# EAGLE design main (EAGLE 8.4.0)
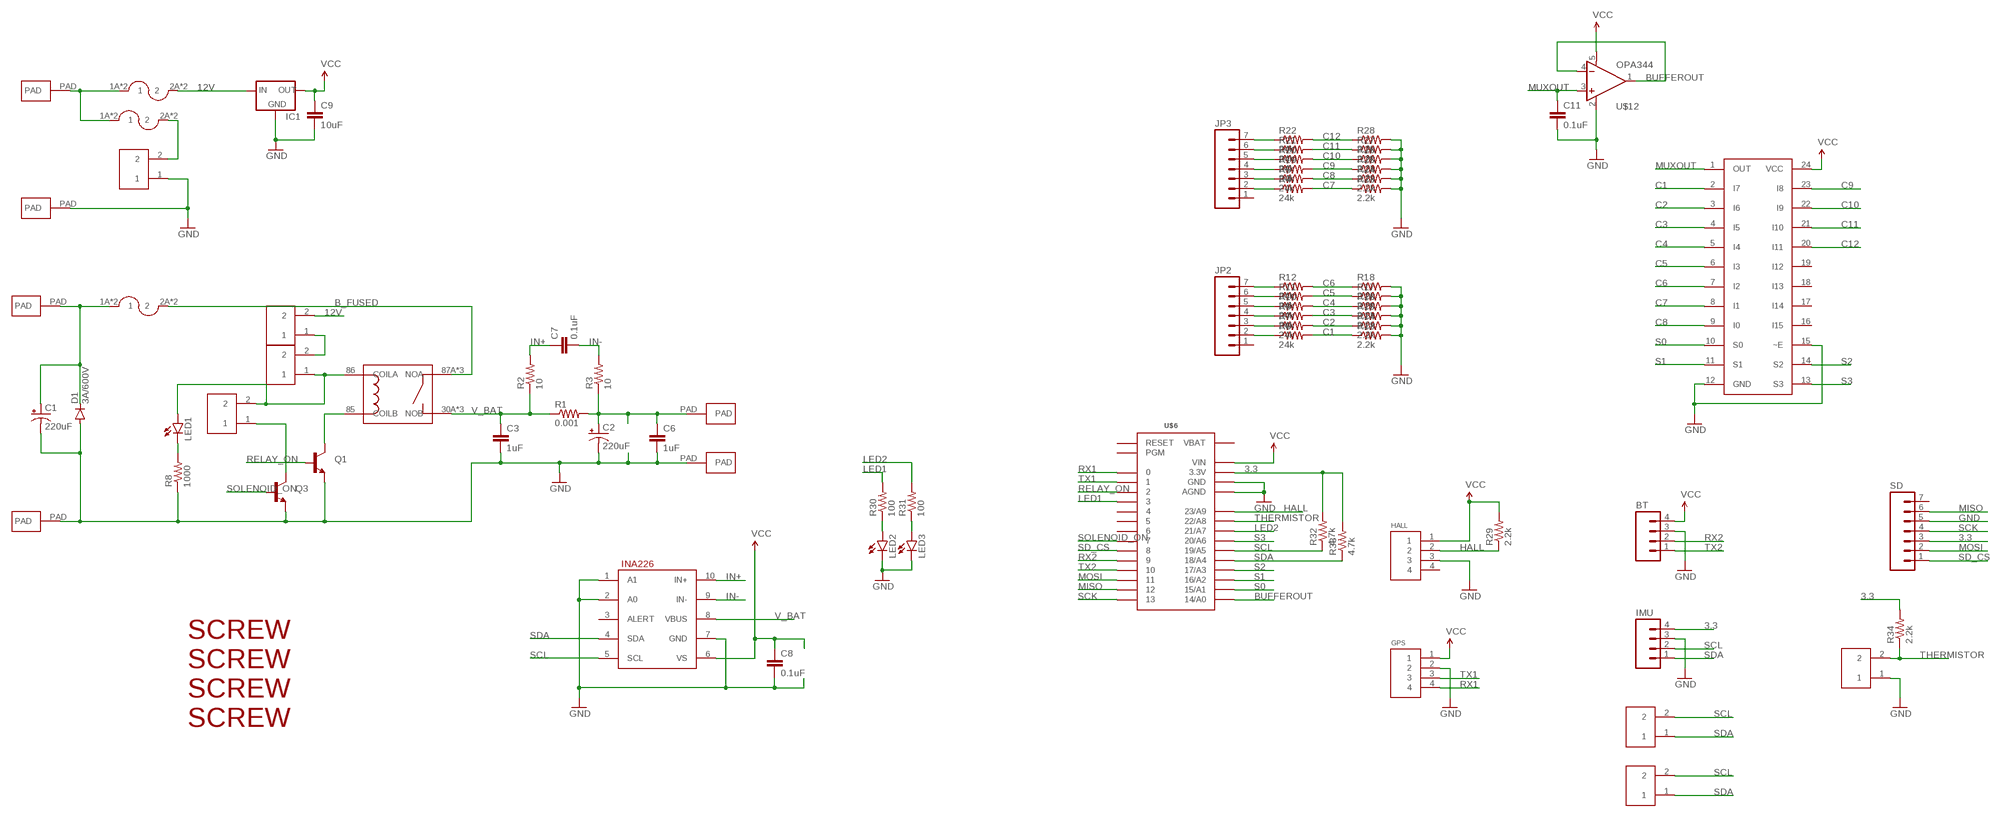
[diagram p0: schematic, sheet 1]

## Parts
BT  M04PTH  [1X04]
C1  220uF  CAP_POLPTH4  [CPOL-RADIAL-1000UF-25V]
C2  220uF  CAP_POLPTH4  [CPOL-RADIAL-1000UF-25V]
C3  1uF  CAP1206  [1206]
C6  1uF  CAP1206  [1206]
C7  0.1uF  CAP0603-CAP  [0603-CAP]
C8  0.1uF  CAP0603-CAP  [0603-CAP]
C9  10uF  CAP0805  [0805]
C11  0.1uF  CAP0603-CAP  [0603-CAP]
D1  3A/600V  DIODEES3J  [SMC]
GPS  GPS  HEADER4VALULOK  [4PINVALULOK]
HALL  HEADER4VALULOK  [4PINVALULOK]
IC1  V_REG_78XXSINK  [TO220-IGO]
IMU  M04PTH  [1X04]
JP2  M07  [1X07]
JP3  M07  [1X07]
LED1  LED1206  [LED-1206]
LED2  LED1206  [LED-1206]
LED3  LED1206  [LED-1206]
Q1  TRANSISTOR_NPNSMD2  [SOT223]
Q3  TRANSISTOR_NPNSMD2  [SOT223]
R1  0.001  RESISTOR2512  [R2512]
R2  10  RESISTOR0603-RES  [0603-RES]
R3  10  RESISTOR0603-RES  [0603-RES]
R4  24k  RESISTOR0603-RES  [0603-RES]
R5  24k  RESISTOR0603-RES  [0603-RES]
R6  24k  RESISTOR0603-RES  [0603-RES]
R7  24k  RESISTOR0603-RES  [0603-RES]
R8  1000  RESISTOR0603-RES  [0603-RES]
R9  24k  RESISTOR0603-RES  [0603-RES]
R10  24k  RESISTOR0603-RES  [0603-RES]
R11  24k  RESISTOR0603-RES  [0603-RES]
R12  24k  RESISTOR0603-RES  [0603-RES]
R13  2.2k  RESISTOR0603-RES  [0603-RES]
R14  2.2k  RESISTOR0603-RES  [0603-RES]
R15  2.2k  RESISTOR0603-RES  [0603-RES]
R16  2.2k  RESISTOR0603-RES  [0603-RES]
R17  2.2k  RESISTOR0603-RES  [0603-RES]
R18  2.2k  RESISTOR0603-RES  [0603-RES]
R19  24k  RESISTOR0603-RES  [0603-RES]
R20  24k  RESISTOR0603-RES  [0603-RES]
R21  24k  RESISTOR0603-RES  [0603-RES]
R22  24k  RESISTOR0603-RES  [0603-RES]
R23  2.2k  RESISTOR0603-RES  [0603-RES]
R24  2.2k  RESISTOR0603-RES  [0603-RES]
R25  2.2k  RESISTOR0603-RES  [0603-RES]
R26  2.2k  RESISTOR0603-RES  [0603-RES]
R27  2.2k  RESISTOR0603-RES  [0603-RES]
R28  2.2k  RESISTOR0603-RES  [0603-RES]
R29  2.2k  RESISTOR0603-RES  [0603-RES]
R30  100  RESISTOR0603-RES  [0603-RES]
R31  100  RESISTOR0603-RES  [0603-RES]
R32  4.7k  RESISTOR0603-RES  [0603-RES]
R33  4.7k  RESISTOR0603-RES  [0603-RES]
R34  2.2k  RESISTOR0603-RES  [0603-RES]
SD  M07  [1X07]
U$1  INA226  [PSOP-10]
U$2  PAD  [PAD]
U$3  PAD  [PAD]
U$4  PAD  [PAD]
U$5  PAD  [PAD]
U$6  TEENSY_3.0_BASIC  [TEENSY_3.0_BASIC]
U$7  RELAY  [PANASONIC_HP_RELAY]
U$8  FUSE  [AUTO_FUSE]
U$9  HEADER2  [2PINVALULOK]
U$10  HEADER2  [2PINVALULOK]
U$11  CD74HC4067  [SO-24DW]
U$12  OPA344  [SOT23-5]
U$13  SCREW  [M3HOLE]
U$14  SCREW  [M3HOLE]
U$15  SCREW  [M3HOLE]
U$16  SCREW  [M3HOLE]
U$17  HEADER2  [2PINVALULOK]
U$18  FUSE  [AUTO_FUSE]
U$19  HEADER2  [2PINVALULOK]
U$20  PAD  [PAD]
U$21  PAD  [PAD]
U$22  FUSE  [AUTO_FUSE]
U$23  HEADER2  [2PINVALULOK]
U$24  HEADER2  [2PINVALULOK]
U$25  HEADER2  [2PINVALULOK]

## Nets
3.3: IMU.4 R32.2 R33.2 R34.2 SD.3 U$6.3.3V U$6.3.3V1(3.3V)
12V: IC1.IN U$10.2 U$22.2A U$22.2B
B_FUSED: U$7.87A(NOA) U$7.87B(NOA) U$7.87C(NOA) U$8.2A U$8.2B
B_OUT: C2.+ C6.1 R1.2 R3.1 U$4.PAD
B_RAW: C1.+ D1.C U$2.PAD U$8.1A U$8.1B
BUFFEROUT: U$6.14/A0 U$12.1(OUT) U$12.4(-IN)
C1: R6.2 R13.1 U$11.2(I7)
C2: R7.2 R14.1 U$11.3(I6)
C3: R9.2 R15.1 U$11.4(I5)
C4: R10.2 R16.1 U$11.5(I4)
C5: R11.2 R17.1 U$11.6(I3)
C6: R12.2 R18.1 U$11.7(I2)
C7: R4.2 R23.1 U$11.8(I1)
C8: R5.2 R24.1 U$11.9(I0)
C9: R19.2 R25.1 U$11.23(I8)
C10: R20.2 R26.1 U$11.22(I9)
C11: R21.2 R27.1 U$11.21(I10)
C12: R22.2 R28.1 U$11.20(I11)
GND: BT.3 C1.- C2.- C3.2 C6.2 C8.2 C9.2 C11.2 D1.A GPS.2 HALL.3 IC1.GND IMU.3 LED2.C LED3.C Q1.3(E) Q3.3(E) R8.1 R13.2 R14.2 R15.2 R16.2 R17.2 R18.2 R23.2 R24.2 R25.2 R26.2 R27.2 R28.2 SD.5 U$1.1(A1) U$1.2(A0) U$1.7(GND) U$3.PAD U$5.PAD U$6.AGND U$6.GND U$6.GND1(GND) U$11.12(GND) U$11.15(~E) U$12.2(V-) U$17.1 U$19.1 U$21.PAD
HALL: HALL.2 R29.1 U$6.23/A9
IN+: C7.1 R2.2 U$1.10(IN+)
IN-: C7.2 R3.2 U$1.9(IN-)
LED1: R30.2 U$6.3
LED2: R31.2 U$6.21/A7
MISO: SD.6 U$6.12
MOSI: SD.2 U$6.11
MUXOUT: C11.1 U$11.1(OUT) U$12.3(+IN)
N$1: JP2.7 R12.1
N$2: LED2.A R30.1
N$3: JP2.6 R11.1
N$4: JP2.5 R10.1
N$5: U$18.2A U$18.2B U$19.2
N$6: JP2.4 R9.1
N$7: U$9.2 U$10.1
N$8: JP2.3 R7.1
N$9: LED1.C R8.2
N$10: Q1.2(C) U$7.85(COILB)
N$11: JP2.2 R6.1
N$14: JP3.7 R22.1
N$15: JP3.6 R21.1
N$16: JP3.5 R20.1
N$17: JP3.4 R19.1
N$18: JP3.3 R5.1
N$19: JP3.2 R4.1
N$20: LED3.A R31.1
N$22: LED1.A U$7.86(COILA) U$9.1 U$23.2
N$23: U$18.1A U$18.1B U$20.PAD U$22.1A U$22.1B
N$24: Q3.2(C) U$23.1
RELAY_ON: Q1.1(B) U$6.2
RX1: GPS.4 U$6.0
RX2: BT.2 U$6.9
S0: U$6.15/A1 U$11.10(S0)
S1: U$6.16/A2 U$11.11(S1)
S2: U$6.17/A3 U$11.14(S2)
S3: U$6.20/A6 U$11.13(S3)
SCK: SD.4 U$6.13
SCL: IMU.2 R32.1 U$1.5(SCL) U$6.19/A5 U$24.2 U$25.2
SD_CS: SD.1 U$6.8
SDA: IMU.1 R33.1 U$1.4(SDA) U$6.18/A4 U$24.1 U$25.1
SOLENOID_ON: Q3.1(B) U$6.7
THERMISTOR: R34.1 U$6.22/A8 U$17.2
TX1: GPS.3 U$6.1
TX2: BT.1 U$6.10
V_BAT: C3.1 R1.1 R2.1 U$1.8(VBUS) U$7.30A(NOB) U$7.30B(NOB) U$7.30C(NOB)
VCC: BT.4 C8.1 C9.1 GPS.1 HALL.1 IC1.OUT R29.2 U$1.6(VS) U$6.VIN U$11.24(VCC) U$12.5(V+)
Unconnected: HALL.4 JP2.1 JP3.1 SD.7 U$1.3(ALERT) U$6.4 U$6.5 U$6.6 U$6.PGM U$6.RESET U$11.16(I15) U$11.17(I14) U$11.18(I13) U$11.19(I12)

## Power pins joined to a net without a drawn wire
VBAT: U$6.VBAT

## Library data of the parts
BT IMU = SparkFun-Connectors:M04: Header 4 Standard 4-pin 0.1" header. Use with straight break away headers (SKU : PRT-00116), right angle break away headers (PRT-00553), swiss pins (PRT-00743), machine pins (PRT-00117), and female headers (PRT-00115). Molex polarized connector foot print use with SKU : PRT-08231 with associated crimp pins and housings. 1MM SMD Version SKU: PRT-10208
C1 C2 = SparkFun-Capacitors:CAP_POL: Capacitor Polarized These are standard SMD and PTH capacitors. Normally 10uF, 47uF, and 100uF in electrolytic and tantalum varieties. Always verify the external diameter of the through hole cap, it varies with capacity, voltage, and manufacturer. The EIA devices should be standard.
C3 C6 = SparkFun-Capacitors:CAP: Capacitor Standard 0603 ceramic capacitor, and 0.1" leaded capacitor.
C7-C9 C11 = SparkFun-Passives:CAP: Capacitor Standard 0603 ceramic capacitor, and 0.1" leaded capacitor.
D1 = SparkFun-DiscreteSemi:DIODE: Diode These are standard reverse protection diodes and small signal diodes. SMA package can handle up to about 1A. SOD-323 can handle about 200mA. What the SOD-323 package when ordering, there are some mfgs out there that are 5-pin packages.; PROD_ID: DIO-12441
GPS HALL = Custom_old:HEADER4
IC1 = SparkFun-PowerIC:V_REG_78XX: Voltage Regulator Standard 7805 5V regulator. IGO (Input Ground Output). Spark Fun Electronics SKU : COM-00107
JP2 JP3 SD = SparkFun-Connectors:M07: Header 7 Standard 7-pin 0.1" header. Use with straight break away headers (SKU : PRT-00116), right angle break away headers (PRT-00553), swiss pins (PRT-00743), machine pins (PRT-00117), and female headers (PRT-00115). NOTES ON THE VARIANTS LOCK and LOCK_LONGPADS... This footprint was designed to help hold the alignment of a through-hole component (i.e. 7-pin header) while soldering it into place. You may notice that each hole has been shifted either up or down by 0.005 of an inch from it's more standard position (which is usually a perfectly straight line). This slight alteration caused the pins (the squares in the middle) to touch the edges of the holes. Because they are alternating, it causes a "brace" to hold the header in place. 0.005 has proven to be the perfect amount of "off-center" position when using our standard breakaway headers. Although looks a little odd when you look at the bare footprint, once you have a header in there, the alteration is very hard to notice. Also, if you push a header all the way into place, it is covered up entirely on the bottom side. This idea of altering the position of holes to aid alignment will be further integrated into the Sparkfun Library for other footprints. It can help hold any component with 3 or more connection pins.
LED1-LED3 = SparkFun-LED:LED: LEDs Standard schematic elements and footprints for 5mm, 3mm, 1206, and 0603 sized LEDs. 5mm - Spark Fun Electronics SKU : COM-00529 (and others)
Q1 Q3 = SparkFun-DiscreteSemi:TRANSISTOR_NPN: Generic NPN BJT MMBT2222A - TRANS-08049 (SOT-23, 1A 40V) MPSA42 - TRANS-09116 (SOT-23, 500mA 300V) MMBT5088LT1G - TRANS-11160 (SOT-23, 50 mA 30V) BC547 - COM-08928 <http://www.sparkfun.com/products/8928> (TO-92 45V 100mA) (1.Collector 2.Base 3.Emitter) 2N3904 - COM-00521 <http://www.sparkfun.com/products/521> (TO-92 40V 200mA) (1.Emitter 2.Base 3.Collector) P2N2222A - COM-12852 <http://www.sparkfun.com/products/12852> (TO-92 40V 600mA) (1.Collector 2.Base 3.Emitter)
R1 = SparkFun-Resistors:RESISTOR: Resistor Basic schematic elements and footprints for 0603, 1206, and PTH resistors.
R2-R34 = SparkFun-Passives:RESISTOR: Resistor Basic schematic elements and footprints for 0603, 1206, and PTH resistors.
U$1 = Custom_old:INA226
U$2-U$5 U$20 U$21 = Custom_old:PAD
U$6 = Teensy3.0:TEENSY_3.0_BASIC: Basic Teensy 3.0 with none of the 'inner' pins enabled. See '+4', 'AllAnalogPins", and 'AllPins' packages for additional pin holes, as needed.
U$7 = Custom_old:RELAY
U$8 U$18 U$22 = Custom_old:FUSE
U$9 U$10 U$17 U$19 U$23-U$25 = Custom_old:HEADER2
U$11 = Custom_old:CD74HC4067
U$12 = SparkFun-AnalogIC:OPA344: Single gate rail-to-rail output op-amp. Inputs extend 300mV past rails.
U$13-U$16 = Custom_old:SCREW

## Board
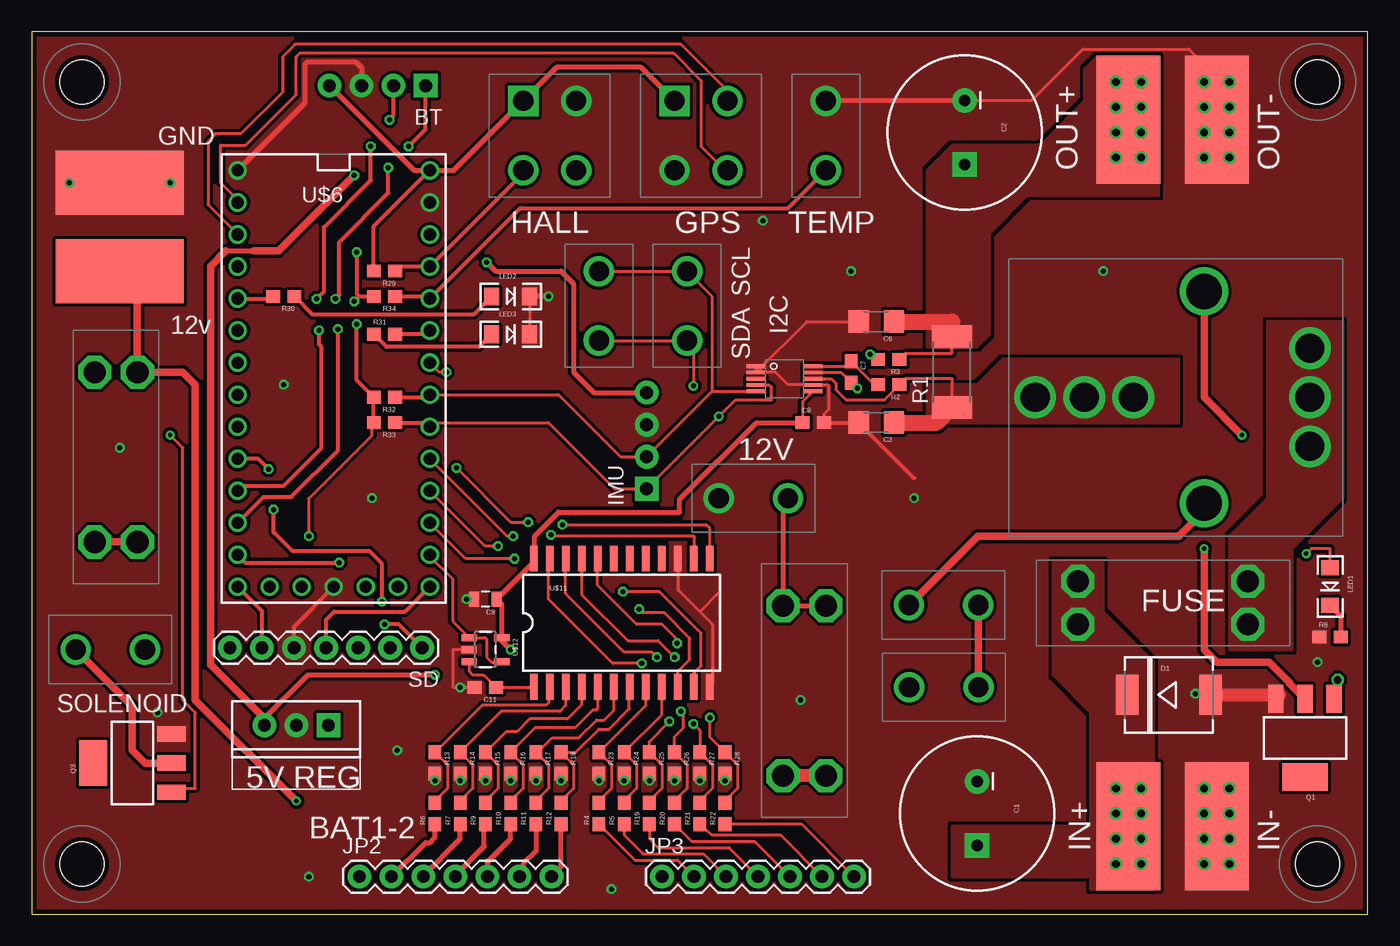
[diagram p1: board, top side]
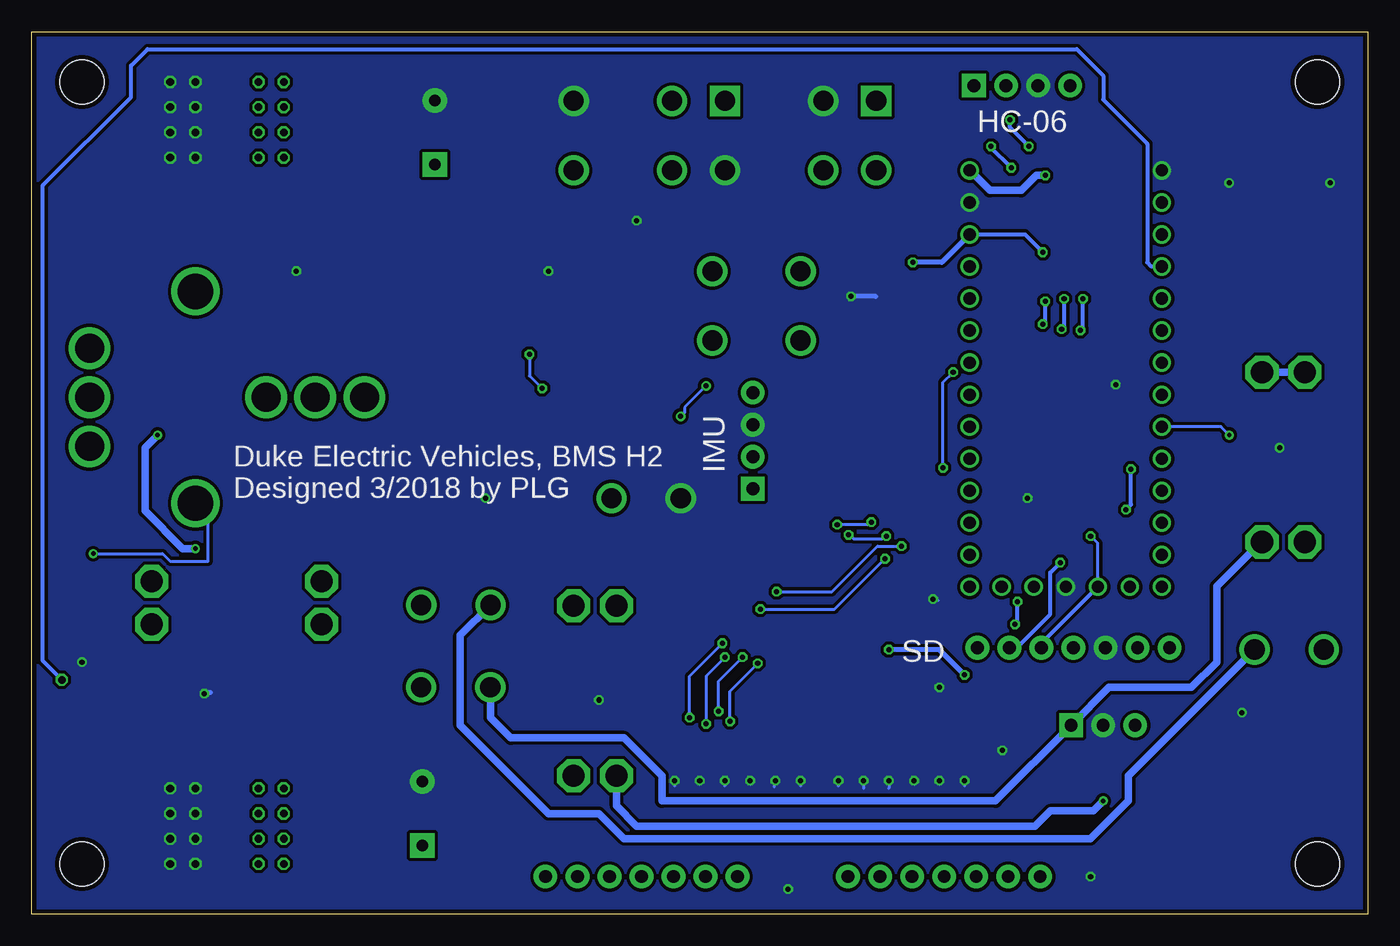
[diagram p2: board, bottom side, seen from below]

Size 106 x 70 mm. Coordinates in mm from the lower left corner, seen from the top.
Outline: 0,0 106,0 106,70 0,70 0,0
Copper layers (1*16): Top 0.0356mm / dielectric 1.5011mm / Bottom 0.0356mm
Design rules "PatrickOSHPARK *": minimum track width 6mil, minimum drill 13mil, track to track 6mil, track to pad 6mil, pad to pad 6mil, via to via 6mil, smd to smd 6mil, copper to edge 15mil, drill to drill 6mil, minimum pad ring 7mil, minimum via ring 7mil, stop-mask expansion 3mil, vias tented up to drill 20mil, thermal gap 10mil

### Footprints (pad centres in the part's own frame; a part is rotated, then mirrored left to right if it is on the bottom)
1X04 = drill 1.016 pad 1.88 square: 1 0,0 | drill 1.016 pad 1.88: 2 2.54,0; 3 5.08,0; 4 7.62,0
CPOL-RADIAL-1000UF-25V = drill 0.9 pad 1.93 square: + 2.54,0 | drill 0.9 pad 1.93: - -2.54,0
1206 = smd 1.6 x 1.8: 1 -1.4,0; 2 1.4,0
0603-CAP = smd 1.1 x 1: 1 -0.85,0; 2 0.85,0
0805 = smd 0.8 x 1.2: 1 -0.9,0; 2 0.9,0
SMC = smd 1.778 x 3.175: A 3.302,0; C -3.302,0
4PINVALULOK = drill 1.6 square: 1 0,5.5 | drill 1.6: 2 0,0; 3 4.2,5.5; 4 4.2,0
TO220-IGO = drill 1 pad 1.88: GND 0,0; OUT 2.54,0 | drill 1 pad 1.88 square: IN -2.54,0
1X07 = drill 1.016 pad 1.88: 1 0,0; 2 2.54,0; 3 5.08,0; 4 7.62,0; 5 10.16,0; 6 12.7,0; 7 15.24,0
LED-1206 = smd 1.2 x 1.4: A -1.5,0; C 1.5,0
SOT223 = smd 1.219 x 2.235: 1 -2.311,-3.099; 2 0,-3.099; 3 2.311,-3.099 | smd 3.6 x 2.2: 4 0,3.099
R2512 = smd 1.8 x 3.2: 1 -2.8,0; 2 2.8,0
0603-RES = smd 1.1 x 1: 1 -0.85,0; 2 0.85,0
PSOP-10 = smd 1.5 x 0.3: 1 0,1; 2 0,0.5; 3 0,0; 4 0,-0.5; 5 0,-1; 6 4.5,-1; 7 4.5,-0.5; 8 4.5,0; 9 4.5,0.5; 10 4.5,1
PAD = smd 10.16 x 5.08: PAD 0,0
TEENSY_3.0_BASIC = drill 0.965: 0 -7.62,13.97; 1 -7.62,11.43; 2 -7.62,8.89; 3 -7.62,6.35; 3.3V 7.62,11.43; 3.3V1 -2.54,-16.51; 4 -7.62,3.81; 5 -7.62,1.27; 6 -7.62,-1.27; 7 -7.62,-3.81; 8 -7.62,-6.35; 9 -7.62,-8.89; 10 -7.62,-11.43; 11 -7.62,-13.97; 12 -7.62,-16.51; 13 7.62,-16.51; 14/A0 7.62,-13.97; 15/A1 7.62,-11.43; 16/A2 7.62,-8.89; 17/A3 7.62,-6.35; 18/A4 7.62,-3.81; 19/A5 7.62,-1.27; 20/A6 7.62,1.27; 21/A7 7.62,3.81; 22/A8 7.62,6.35; 23/A9 7.62,8.89; AGND 7.62,13.97; GND -7.62,16.51; GND1 0,-16.51; PGM 2.54,-16.51; RESET 5.08,-16.51; VBAT -5.08,-16.51; VIN 7.62,16.51
PANASONIC_HP_RELAY = drill 2.3: 30A 5.6,0; 30B 9.5,0; 30C 13.4,0; 87A -8.4,3.9; 87B -8.4,0; 87C -8.4,-3.9 | drill 2.8: 85 0,-8.4; 86 0,8.4
AUTO_FUSE = drill 1.75 octagon: 1A 0,3.4; 1B 0,0; 2A 13.47,3.4; 2B 13.47,0
2PINVALULOK = drill 1.6: 1 0,5.5; 2 0,0
SO-24DW = smd 0.584 x 2.032: 1 -6.35,-5.08; 2 -5.08,-5.08; 3 -3.81,-5.08; 4 -2.54,-5.08; 5 -1.27,-5.08; 6 0,-5.08; 7 1.27,-5.08; 8 2.54,-5.08; 9 3.81,-5.08; 10 5.08,-5.08; 11 6.35,-5.08; 12 7.62,-5.08; 13 7.62,5.08; 14 6.35,5.08; 15 5.08,5.08; 16 3.81,5.08; 17 2.54,5.08; 18 1.27,5.08; 19 0,5.08; 20 -1.27,5.08; 21 -2.54,5.08; 22 -3.81,5.08; 23 -5.08,5.08; 24 -6.35,5.08
SOT23-5 = smd 0.55 x 1.2: 1 -0.95,-1.3; 2 0,-1.3; 3 0.95,-1.3; 4 0.95,1.3; 5 -0.95,1.3
M3HOLE = hole 3.5: 0,0

### Placement (x,y rotation side)
BT  31.25,65.71 180 top
C1  75,8 270 top
C2  74,62 270 top
C3  67,39 180 top
C6  67,47 180 top
C7  65,43 270 top
C8  62,39 0 top
C9  36,25 180 top
C11  36,18 180 top
D1  90.2,17.4 0 top
GPS  51,59 0 top
HALL  39,59 0 top
IC1  21,15 180 top
IMU  48.79,33.75 90 top
JP2  26,3 0 top
JP3  50,3 0 top
LED1  103,26 270 top
LED2  38,49 0 top
LED3  38,46 0 top
Q1  101,14 180 top
Q3  8,12 90 top
R1  73,43 90 top
R2  68,42 180 top
R3  68,44 180 top
R4  45,8 90 top
R5  47,8 90 top
R6  32,8 90 top
R7  34,8 90 top
R8  103,22 0 top
R9  36,8 90 top
R10  38,8 90 top
R11  40,8 90 top
R12  42,8 90 top
R13  32,12 270 top
R14  34,12 270 top
R15  36,12 270 top
R16  38,12 270 top
R17  40,12 270 top
R18  42,12 270 top
R19  49,8 90 top
R20  51,8 90 top
R21  53,8 90 top
R22  55,8 90 top
R23  45,12 270 top
R24  47,12 270 top
R25  49,12 270 top
R26  51,12 270 top
R27  53,12 270 top
R28  55,12 270 top
R29  28,51 180 top
R30  20,49 180 top
R31  28,46 0 top
R32  28,41 180 top
R33  28,39 180 top
R34  28,49 180 top
SD  30.98,21.14 180 top
U$1  57.47,42.47 0 top
U$2  87,7 90 top
U$3  94,63 90 top
U$4  87,63 90 top
U$5  94,7 90 top
U$6  23.97,42.48 0 top
U$7  93,41 180 top
U$8  83,23 0 top
U$9  75.09,24.53 90 top
U$10  69.61,18.02 270 top
U$11  46.18,23.13 0 top
U$12  36,21 270 top
U$13  102,4 0 top
U$14  102,66 0 top
U$15  4,66 0 top
U$16  4,4 0 top
U$17  63,59 0 top
U$18  63,11 90 top
U$19  60,33 90 top
U$20  7,51 0 top
U$21  7,58 0 top
U$22  5,43 270 top
U$23  9,21 90 top
U$24  45,51 180 top
U$25  52,51 180 top

### Tracks (layer width: path | path; a pad name or v marks a point on that pad's centre or on a via)
3.3  (via drill 0.4)
  Top 0.254: v22,30 22,33 27,38 27,38.85 R33.2
  Top 0.305: v25.8,52.5 25.8,49.2 26,49 | 26,49 R34.2 | R33.2 R32.2 25.8,42.35 v25.8,46.8 | v25.6,48.6 26,49
  Top 0.406: v36.1,51.7 36.8,51 42,51 43,50 43,43 44.63,41.37 IMU.4
  Bottom 0.254: U$6.3.3V1 21.43,29.43 v22,30
  Bottom 0.305: U$6.3.3V 27.21,53.91 v25.8,52.5 | v25.8,46.8 25.6,47 v25.6,48.6 | SD.3 25.9,21.5 U$6.3.3V1
  Bottom 0.406: U$6.3.3V 33.8,51.7 v36.1,51.7
12V
  Top 0.61: U$22.2B U$22.2A
  Bottom 0.61: U$22.2A 8.47,29.53 12,26 12,20 14,18 20.54,18 IC1.IN 29.54,9 56,9 56,11 59,14 68,14 69.61,15.61 U$10.2
B_FUSED
  pour Top (isolate 0.254, no thermals): 95,30 95,21 100,21 100,29 104,33 104,47 98,47 98,33
B_OUT  (via drill 0.6)
  Top 0.254: R3.1 69.35,44.5 73,44.5 R1.2 73,47
  Top 1.27: C6.1 73,47
  other vias: 86,60 88,60 88,62 86,62 88,64 86,64 86,66 88,66
  pour Top (isolate 0.254, no thermals): 71,45 75,45 76,46 76,54 79,57 89.4,57 89.4,68 84.5,68 83.5,67 83.5,64.5 80,61 73,61 71,59
B_RAW  (via drill 0.6)
  other vias: 86,10 88,10 86,4 88,4 88,6 86,6 86,8 88,8
  pour Top (isolate 0.254, no thermals): 89,2 89,20 85,24 85,28 81,28 81,19 84,16 84,2
  pour Top (isolate 0.254, no thermals): 73,7 73,3 89,3 89,8 88,7
BUFFEROUT
  Top 0.254: U$12.4 37.25,20 36.5,20 36.1,20.4 36.1,21.8 35.95,21.95 U$12.1 33.4,23.25 33.4,26.6 31.59,28.41 U$6.14/A0
C1
  Top 0.254: R6.2 32,9 33,10 33,11.85 R13.1 35.75,16.6 40.8,16.6 41,16.8 41,17.95 U$11.2
C2
  Top 0.254: R7.2 34,9 35,10 35,11.85 R14.1 37.25,16.1 41.9,16.1 42.37,16.57 U$11.3
C3
  Top 0.254: R9.2 36,9 37,10 37,11.85 R15.1 37.65,14.5 38.5,14.5 39.5,15.5 42.5,15.5 43.64,16.64 U$11.4
C4
  Top 0.254: R10.2 38,9 39,10 39,11.85 R16.1 39.95,14.8 43.1,14.8 44.5,16.2 44.8,16.2 44.91,16.31 U$11.5
C5
  Top 0.254: R11.2 40,9 41,10 41,11.85 R17.1 40.15,12.85 41.3,14 43.4,14 44.8,15.4 45.4,15.4 46.2,16.2 46.2,18.03 U$11.6
C6
  Top 0.254: R12.2 42,9 43,10 43,11.85 R18.1 43.15,12.85 45,14.7 45.8,14.7 47.4,16.3 47.4,18 U$11.7
C7
  Top 0.254: R4.2 45,9 46,10 46,11.85 R23.1 48.72,16.57 U$11.8
C8
  Top 0.254: R5.2 47,9 48,10 48,11.85 R24.1 49.99,15.84 U$11.9
C9  (via drill 0.4)
  Top 0.254: R19.2 49,9 50,10 50,11.85 R25.1 49,13.7 v50.6,15.3 | v48.4,19.9 46.1,19.9 41,25 41,28.11 U$11.23
  Bottom 0.254: v50.6,15.3 50.6,17.7 v48.4,19.9
C10  (via drill 0.4)
  Top 0.254: R20.2 51,9 52,10 52,11.85 R26.1 51,14.1 51.7,14.8 51.7,15.9 v51.5,16.1 | v49.6,20.4 49.2,20.8 47,20.8 42.37,25.43 U$11.22
  Bottom 0.254: v51.5,16.1 51.5,18.5 v49.6,20.4
C11  (via drill 0.4)
  Top 0.254: R21.2 53,9 54,10 54,11.85 R27.1 53,14.6 v52.5,15.1 | U$11.21 43.64,25.36 47.3,21.7 49.7,21.7 v51,20.4
  Bottom 0.254: v51,20.4 52.5,18.9 v52.5,15.1
C12  (via drill 0.4)
  Top 0.254: R22.2 55,9 56,10 56,11.85 R28.1 53.8,14.05 v53.8,15.6 | v51.2,21.5 51.2,21.8 50,23 48,23 44.91,26.09 U$11.20
  Bottom 0.254: v53.8,15.6 53.8,18.9 v51.2,21.5
GND  (via drill 0.4, 0.6)
  Top 0.254: C6.2 61.5,47 U$1.2 U$1.1 57.53,43.47 58,43 59,43 60,42 61.94,42 U$1.7 62,42 63.1,42 63.2,41.9 63.2,40 62.85,39.65 C8.2 | U$11.15 51.26,25.74 53,24 | 53,24 54,23 54,18.25 U$11.12 | 54.5,25.5 53,24 | R13.2 v32,10.6 | R14.2 v34,10.6 | R15.2 v36,10.6 | R16.2 v38,10.6 | R17.2 v40,10.6 | R18.2 v42,10.6 | R23.2 v45,10.6 | R24.2 v47,10.6 | R25.2 v49,10.6 | R26.2 v51,10.6 | R27.2 v53,10.6 | R28.2 v55,10.6 | U$12.2 33.4,21 33.4,18 v34,18 C11.2 | C9.2 v34.5,25 | C2.- 79.34,64.54 83.4,68.6 91.8,68.6 94.4,66 94.4,63.4 U$3.PAD | LED2.C LED3.C | v93,6 93.5,6.5 93.5,7
  Top 0.305: SD.5 20.82,22.82 U$6.GND1 | 70,34.6 C3.2 C8.2
  Top 0.406: U$17.1 63.04,64.54 C2.- | U$6.GND 21.7,64.34 21.7,67.4 21.9,67.6 25.7,67.6 26.17,67.13 BT.3 | v41,49 LED2.C | D1.A 93.4,17.5 v92.3,17.5
  Top 1.016: U$5.PAD 93.5,7 | D1.A 98.99,17.4
  Bottom 0.254: v32,10.6 32,10.2 | v34,10.6 34,10.3 | v36,10.6 36,10.3 | v38,10.6 38,10 | v40,10.6 40,10 | v42,10.6 42,10.2 | v45,10.6 45,10.2 | v47,10.6 47.1,10.6 47.1,10.1 | v49,10.6 49,10.3 | v51,10.6 51,10.2 | v53,10.6 53,10.3 | v55,10.6 55,10.2 | v34.5,25 34.5,24.9 34.1,24.9
  Bottom 0.406: 39.04,49 v41,49 | v92.3,17.5 92.2,17.6 91.8,17.6
  other vias: 93,10 93,8 93,4 95,4 95,6 95,8 95,10 58,55 65,51 85,51 27,33 29,13 22,3 46,2 61,17 20,42 93,60 95,60 93,62 95,62 95,64 93,64 93,66 95,66 7,37 10,16 102,20 70,33 3,58 11,58
  pour Bottom (isolate 0.254, no thermals): -2,71 -2,-2 108,-2 108,71
  pour Top (isolate 0.254, rank 6, no thermals): 0,70 0,0 106,0 106,70
HALL
  Top 0.305: HALL.2 39,58.78 U$6.23/A9 29.22,51.37 R29.1
IN+
  Top 0.254: U$1.10 64.62,43.47 C7.1 66.85,42 R2.2
IN-  (via drill 0.4)
  Top 0.254: U$1.9 64.18,42.97 C7.2 65.45,41.7 v65.5,41.7 | R3.2 66.9,44 v66.5,44.4
  Bottom 0.254: v66.5,44.4 66.5,42.7 v65.5,41.7
LED1
  Top 0.305: U$6.3 18.98,48.83 R30.2
LED2
  Top 0.305: U$6.21/A7 31.3,46 R31.2
MISO
  Top 0.305: SD.6 18.28,24.04 U$6.12
MOSI  (via drill 0.4)
  Top 0.305: U$6.11 16.96,27.9 v24.4,27.9
  Bottom 0.305: SD.2 27.86,21.14 25.2,23.8 25.2,27.1 v24.4,27.9
MUXOUT
  Top 0.254: U$11.1 39.78,18 C11.1 35.85,19 35,19 34.7,19.3 U$12.3
N$1
  Top 0.406: JP2.7 42,3.76 R12.1
N$2
  Top 0.305: R30.1 22.25,47.6 35.1,47.6 LED2.A
N$3
  Top 0.406: R11.1 40,5 39,4 39,3.3 JP2.6
N$4
  Top 0.406: JP2.5 36.16,4.16 38,6 R10.1
N$5
  Top 0.406: U$18.2B U$18.2A 59.6,32.6 U$19.2
N$6
  Top 0.406: JP2.4 33.62,3.12 35.9,5.4 35.9,7.05 R9.1
N$7
  Top 0.61: U$10.1 75.09,18.04 U$9.2
N$8
  Top 0.406: JP2.3 31.08,3.08 34,6 R7.1
N$9
  Top 0.406: LED1.C 103.85,23.65 R8.2
N$10  (via drill 0.35)
  Top 0.61: Q1.2 99.75,18.34 99.75,18.41 98.16,20 94,20 93,21 v93,29 | v96,38 93,41 U$7.85
  Bottom 0.61: v93,29 94,29 97,32 97,37 v96,38
N$11
  Top 0.406: JP2.2 31.24,5.7 31.6,5.7 32,6.1 R6.1
N$14
  Top 0.254: JP3.7 61.09,7.15 R22.1
N$15
  Top 0.254: R21.1 53.95,6.3 59.4,6.3 JP3.6
N$16
  Top 0.254: R20.1 52.35,5.8 57.36,5.8 JP3.5
N$17
  Top 0.254: R19.1 49,6 49.7,5.3 55.32,5.3 JP3.4
N$18
  Top 0.254: R5.1 47,6.3 48.5,4.8 53.28,4.8 JP3.3
N$19
  Top 0.254: R4.1 47.85,4.3 51.24,4.3 JP3.2
N$20
  Top 0.305: LED3.A 35.5,45 28.15,45 R31.1
N$22  (via drill 0.35)
  Top 0.254: LED1.A 103,29 101.5,29 v101.1,28.6
  Top 0.61: U$9.1 75.06,30 91,30 93,32 U$7.86
  Bottom 0.254: v101.1,28.6 95.6,28.6 95,28 92,28 92,31.6 U$7.86
  Bottom 0.61: U$23.2 19,11 19,9 22,6 59,6 61,8 65,8 72,15 72,22.12 U$9.1
N$23  (via drill 0.35)
  Top 0.61: v21,9 13,17 13,42 12,43 U$22.1A 8.4,49.6 U$20.PAD
  Top 1.016: U$18.1B U$18.1A
  Bottom 0.61: U$22.1B U$22.1A | v21,9 21.8,8.2 25.2,8.2 26.4,7 58,7 59.6,8.6 U$18.1A
N$24
  Top 0.61: U$23.1 8,16.5 8,13 9,12 Q3.2
RELAY_ON  (via drill 0.6)
  Top 0.61: Q1.1 103.6,17.39 v103.6,18.6
  Bottom 0.305: v103.6,18.6 105.1,20.1 105.1,57.8 98.1,64.8 98.1,67.3 96.8,68.6 23.1,68.6 21,66.5 21,64.6 17.5,61.1 17.5,51.7 17.17,51.37 U$6.2
RX1
  Top 0.254: U$6.0 16.35,56.65 15,58 15,61 17,61 21,65 21,68 21.3,68.3 50.9,68.3 53.1,66.1 53.1,60.9 55,59 GPS.4
RX2  (via drill 0.4)
  Top 0.305: U$6.9 16.76,34 20,34 23,37 23,45 22.8,45.2 v22.8,46.3 | v22.6,48.8 23.2,49.4 23.2,54.5 26.9,58.2 v26.9,60.9 | v28.4,63 28.71,63.31 BT.2
  Bottom 0.305: v22.8,46.3 22.6,46.5 v22.6,48.8 | v26.9,60.9 28.4,62.4 v28.4,63
S0  (via drill 0.4)
  Top 0.254: U$11.10 51.26,19.26 52.2,20.2 52.2,21.9 50.2,23.9 48.5,23.9 v48.2,24.2 | v38.3,28.2 34.44,28.2 U$6.15/A1
  Bottom 0.254: v48.2,24.2 42.3,24.2 v38.3,28.2
S1  (via drill 0.4)
  Top 0.254: U$11.11 52.53,19.13 53.1,19.7 53.1,22.3 49.8,25.6 v46.9,25.6 | v37,29.2 35.98,29.2 U$6.16/A2
  Bottom 0.254: v46.9,25.6 42.5,25.6 38.9,29.2 v37,29.2
S2  (via drill 0.4)
  Top 0.254: U$6.17/A3 37.72,30 v38.2,30 | U$11.14 52.53,30 41.2,30 v41.2,30.1
  Bottom 0.254: v41.2,30.1 40.8,29.8 38.5,29.8 38.3,30 v38.2,30
S3  (via drill 0.4)
  Top 0.254: U$11.13 53.8,30.6 53.5,30.9 v42.1,30.9 | v32.9,43 32.34,43 U$6.20/A6 | v33.7,35.4 38,31.1 v39.4,31.1
  Bottom 0.254: v33.7,35.4 33.7,42.2 v32.9,43 | v39.4,31.1 39.6,30.9 v42.1,30.9
SCK
  Top 0.305: SD.4 23.36,23.36 24,24 29.62,24 U$6.13
SCL
  Top 0.254: U$6.19/A5 41.79,41.21 46.71,36.29 IMU.2 53.97,41.47 | 53.97,41.47 U$1.5 | U$24.2 U$25.2 53.97,49.03 53.97,41.47
  Top 0.305: R32.1 31.38,41 U$6.19/A5
SD_CS  (via drill 0.4)
  Top 0.305: SD.1 29.12,23 v28,23 | v27.8,24.8 27.8,27.8 26.8,28.8 20.7,28.8 19.2,30.3 v19.2,32.1 | v18.8,35.3 17.97,36.13 U$6.8
  Bottom 0.305: v28,23 27.8,23.2 v27.8,24.8 | v19.2,32.1 18.8,32.5 v18.8,35.3
SDA  (via drill 0.4)
  Top 0.254: U$6.18/A4 31.92,39 41,39 46.25,33.75 IMU.1 v54.52,39.48 55.84,40.8 58.7,40.8 58.7,41.8 58.53,41.97 U$1.4 | U$24.1 U$25.1 52.5,45 v52.5,41.9
  Top 0.305: R33.1 31.26,39 U$6.18/A4
  Bottom 0.254: v52.5,41.9 54.2,40.2 54.2,39.8 v54.52,39.48
SOLENOID_ON  (via drill 0.35)
  Top 0.254: Q3.1 11.41,10 13,10 13,16 12,17 12,37 v11,38
  Bottom 0.254: v11,38 11.67,38.67 U$6.7
THERMISTOR
  Top 0.305: U$17.2 60,56 38.76,56 U$6.22/A8 31.42,49 R34.1
TX1
  Top 0.254: GPS.3 55.2,65.3 51.5,69 20.9,69 19.9,68 19.9,65.2 16.6,61.9 14.6,61.9 14,61.3 14,56.26 U$6.1
TX2  (via drill 0.4)
  Top 0.305: U$6.10 18.4,33.1 20.6,33.1 24.3,36.8 v24.3,46.4 | v24.1,48.8 24.4,49.1 24.4,53.3 28.3,57.2 v28.3,59.2 | v29.9,60.9 31.25,62.25 BT.1
  Bottom 0.305: v24.3,46.4 24.1,46.6 v24.1,48.8 | v28.3,59.2 29.9,60.8 v29.9,60.9
V_BAT
  Top 0.254: R1.1 73,42.5 69.35,42.5 R2.1 67.65,40.8 64.6,40.8 63.8,41.6 63.8,42.1 63.43,42.47 U$1.8
  Top 1.27: C3.1 71.8,39 R1.1
  pour Top (isolate 0.254, no thermals): 71,42 71,39 91,39 91,44 77,44 75,42
VCC  (via drill 0.4)
  Top 0.254: U$1.6 61.15,40.65 C8.1
  Top 0.305: R29.2 27.15,54.55 U$6.VIN
  Top 0.406: GPS.1 48.3,67.2 41.7,67.2 HALL.1 33.49,58.99 U$6.VIN 30.35,58.99 BT.4 | 15.4,52.6 17.6,52.6 | 18.46,15.54 21.92,19 v32,19 | v38,21 37.3,21.7 U$12.5 37.3,24.6 C9.1 39.83,27.93 U$11.24 39.9,28.28 39.9,30 41.8,31.9 51.4,31.9 51.4,32.9 57.5,39 C8.1
  Top 0.61: IC1.OUT 18.46,15.54 14.2,19.8 14.2,51.4 15.4,52.6 | 17.6,52.6 19.6,52.6 v25.6,58.6
  Bottom 0.406: v32,19 34,21 v38,21
  Bottom 0.61: v25.6,58.6 26.3,58.6 27.5,57.4 30,57.4 U$6.VIN

### Text on the board
tPlace: GND | OUT+ | OUT- | HALL | GPS | TEMP | SCL | 12v | I2C | SDA | 12V | FUSE | SOLENOID | 5V REG | BAT1-2 | IN+ | IN-
bPlace: HC-06 | IMU | Duke Electric Vehicles, BMS H2 / Designed 3/2018 by PLG | SD